# Altium schematic sheet Sheet1.SchDoc
size A3; SheetNumber: 1; SheetTotal: 1
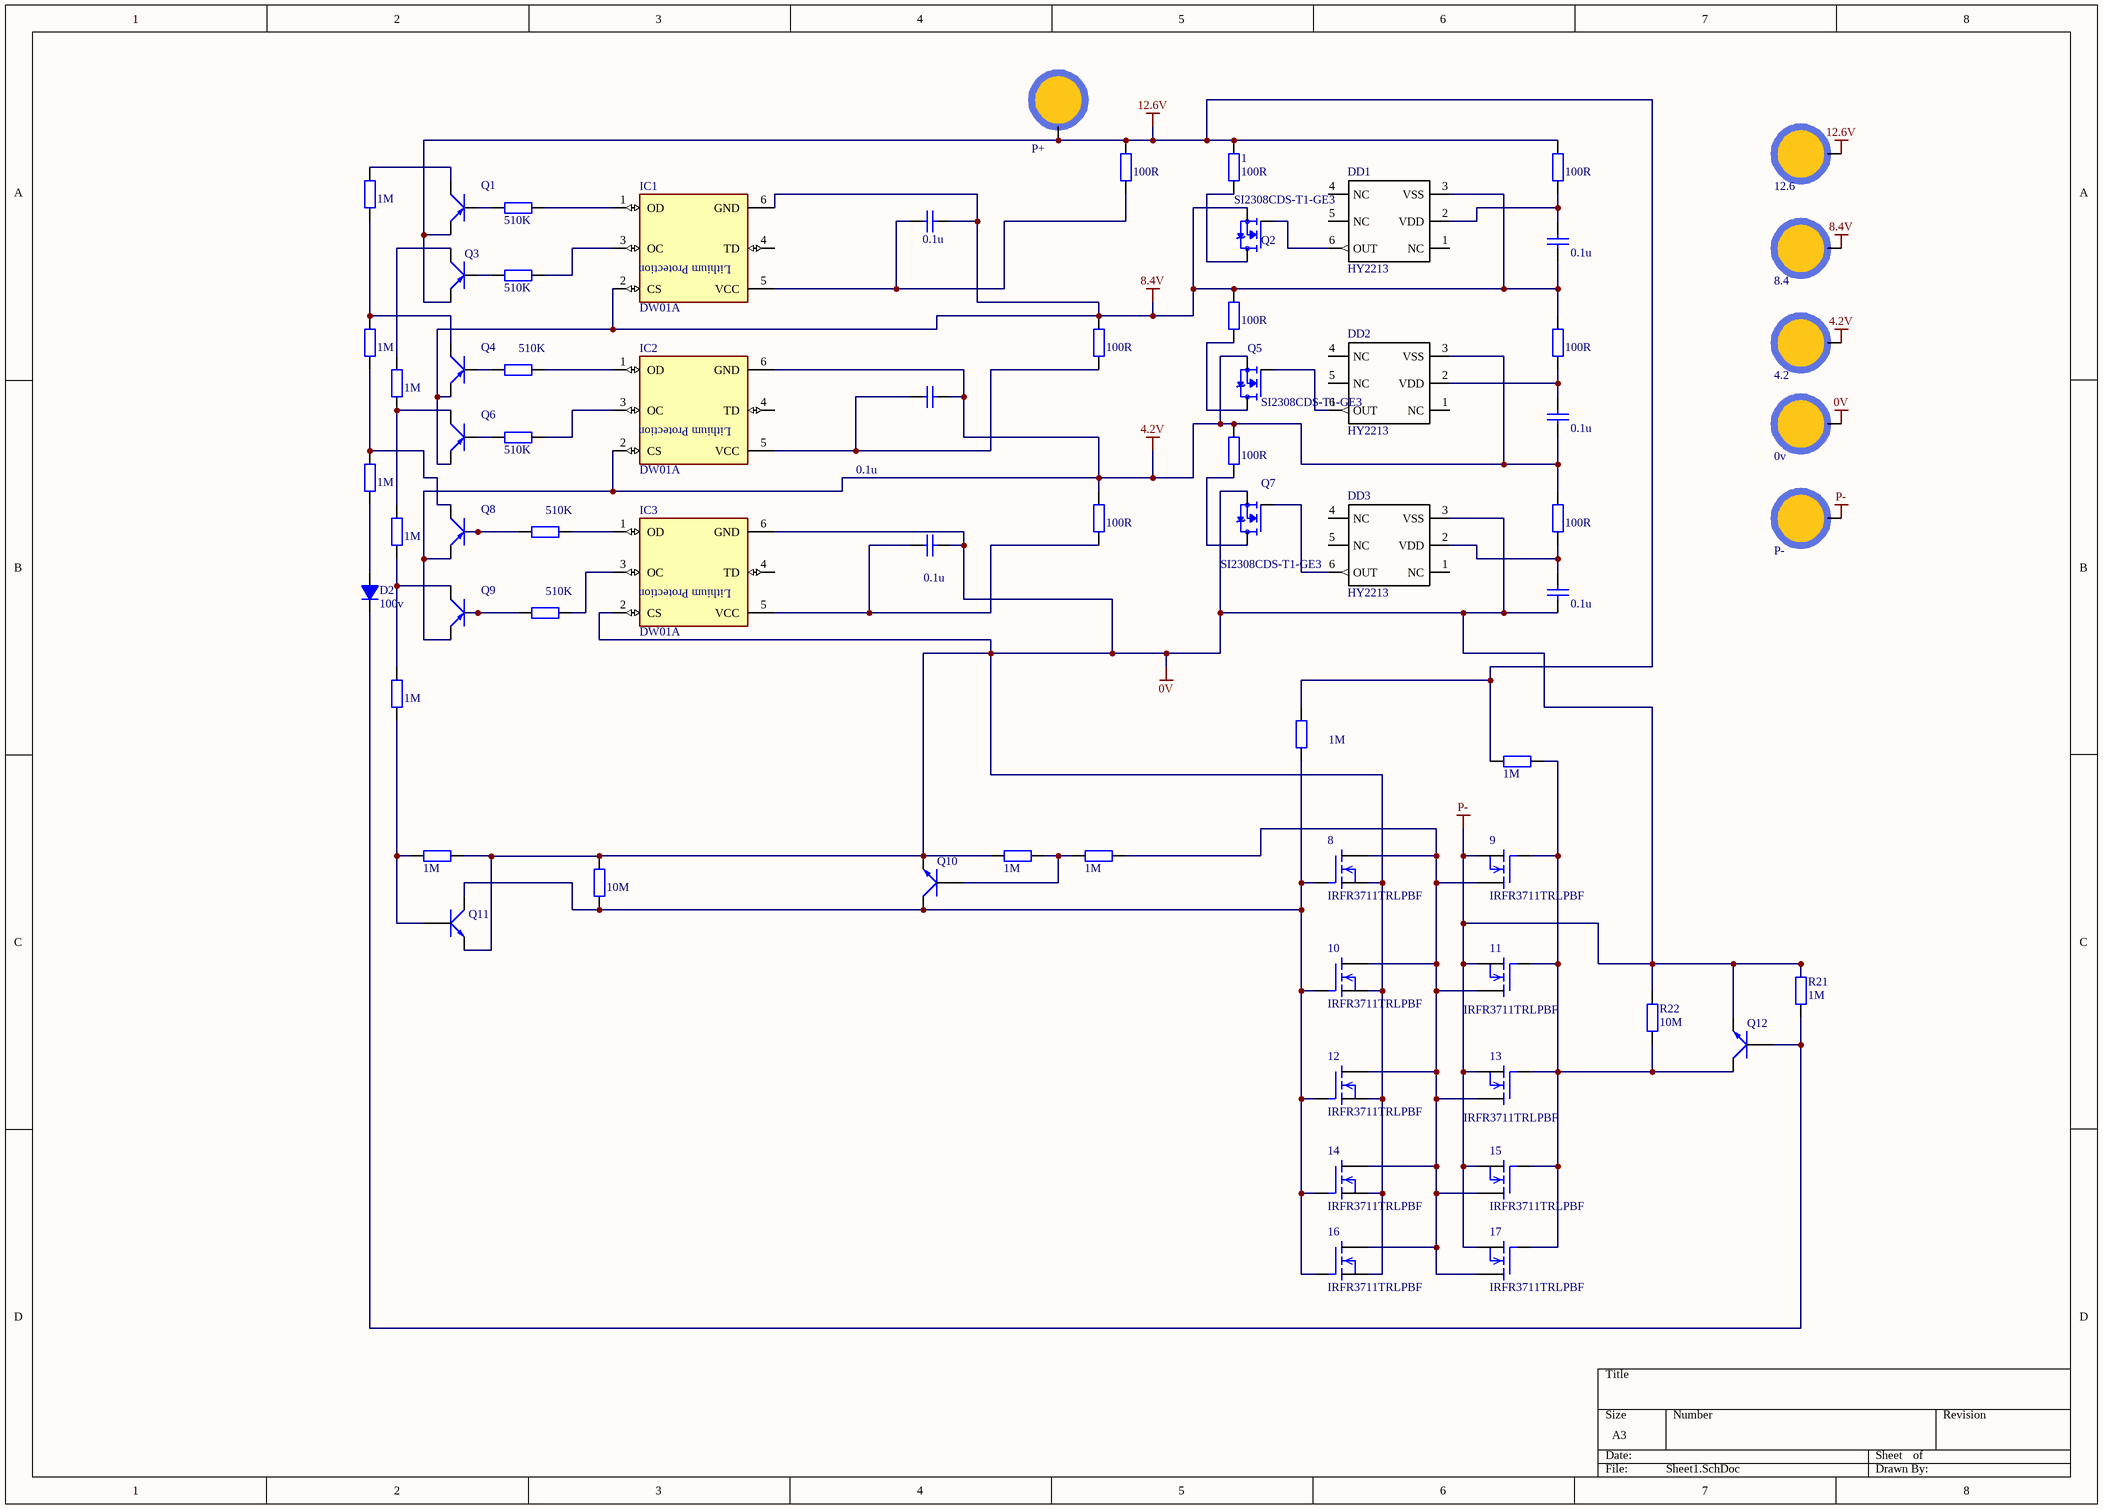
[diagram p0: Sheet1.SchDoc]

## Parts
0v  DNP/MH  [SOMH1]  (value not drawn)  (no BOM)
1  100R  [tro smd 2512]
2  1M  [tro smd 1206]
3  100R  [tro smd 2512]
4  1M  [tro smd 1206]
4.2  DNP/MH  [SOMH1]  (value not drawn)  (no BOM)
5  1M  [tro smd 1206]
6  100R  [tro smd 2512]
7  1M  [tro smd 1206]
8  IRFR3711TRLPBF  [TO252]
8.4  DNP/MH  [SOMH1]  (value not drawn)  (no BOM)
9  IRFR3711TRLPBF  [TO252]
10  IRFR3711TRLPBF  [TO252]
11  IRFR3711TRLPBF  [TO252]
12  IRFR3711TRLPBF  [TO252]
12.6  DNP/MH  [SOMH1]  (value not drawn)  (no BOM)
13  IRFR3711TRLPBF  [TO252]
14  IRFR3711TRLPBF  [TO252]
15  IRFR3711TRLPBF  [TO252]
16  IRFR3711TRLPBF  [TO252]
17  IRFR3711TRLPBF  [TO252]
C1  0.1u  [tu 1206]
C2  0.1u  [tu 1206]
C3  0.1u  [tu 1206]
C4  0.1u  [tu 1206]
C5  0.1u  [tu 1206]
C6  0.1u  [tu 1206]
D2  100v  [DIODE 0.5A]
DD1  HY2213  [SOT23-6]
DD2  HY2213  [SOT23-6]
DD3  HY2213  [SOT23-6]
IC1  DW01A  [SOT23-6]
IC2  DW01A  [SOT23-6]
IC3  DW01A  [SOT23-6]
P+  DNP/MH  [SOMH1]  (value not drawn)  (no BOM)
P-  DNP/MH  [SOMH1]  (value not drawn)  (no BOM)
Q1  BA  [SOT23]  (value not drawn)
Q2  SI2308CDS-T1-GE3  [SOT95P237X112-3N]
Q3  BA  [SOT23]  (value not drawn)
Q4  BA  [SOT23]  (value not drawn)
Q5  SI2308CDS-T1-GE3  [SOT95P237X112-3N]
Q6  BA  [SOT23]  (value not drawn)
Q7  SI2308CDS-T1-GE3  [SOT95P237X112-3N]
Q8  BA  [SOT23]  (value not drawn)
Q9  BA  [SOT23]  (value not drawn)
Q10  HF  [SOT23]  (value not drawn)
Q11  HF  [SOT23]  (value not drawn)
Q12  (no value)  [SOT23]
R1  100R  [tro smd 1206]
R2  100R  [tro smd 1206]
R3  510K  [tro smd 1206]
R4  510K  [tro smd 1206]
R5  510K  [tro smd 1206]
R6  100R  [tro smd 1206]
R7  100R  [tro smd 1206]
R8  510K  [tro smd 1206]
R9  510K  [tro smd 1206]
R10  100R  [tro smd 1206]
R11  100R  [tro smd 1206]
R12  1M  [tro smd 1206]
R13  510K  [tro smd 1206]
R14  1M  [tro smd 1206]
R15  1M  [tro smd 1206]
R16  1M  [tro smd 1206]
R17  1M  [tro smd 1206]
R18  1M  [tro smd 1206]
R19  1M  [tro smd 1206]
R20  10M  [tro smd 1206]
R21  1M  [tro smd 1206]
R22  10M  [tro smd 1206]

## Nets
0V: 0v.1 8.3(S) 9.3(S) 10.3(S) 11.3(S) 12.3(S) 13.3(S) 14.3(S) 15.3(S) 16.3(S) 17.3(S) C5.1 C6.2 DD3.3(VSS) IC3.2(CS) IC3.6(GND) P-.1 Q7.2(S) Q10.2(E) Q11.2(E) Q12.2(E) R17.1 R18.2 R20.1 R21.2 R22.1  [also labelled P-]
4.2V: 4.2.1 6.2 C3.1 C4.2 DD2.3(VSS) IC2.2(CS) IC2.6(GND) Q5.2(S) Q8.2(E) Q9.2(E) R10.2 R11.1
8.4V: 3.2 8.4.1 C1.1 C2.2 DD1.3(VSS) IC1.2(CS) IC1.6(GND) Q2.2(S) Q4.2(E) Q6.2(E) R6.1 R7.1
12.6V: 1.2 12.6.1 P+.1 Q1.2(E) Q3.2(E) R1.1 R2.1 R15.1 R16.1
Net1_1: 1.1 Q2.3(D)
Net2_1: 2.1 4.2 Q4.3(C)
Net2_2: 2.2 Q1.3(C)
Net3_1: 3.1 Q5.3(D)
Net4_1: 4.1 7.2 Q8.3(C)
Net5_1: 5.1 Q6.3(C) R12.2
Net5_2: 5.2 Q3.3(C)
Net6_1: 6.1 Q7.3(D)
Net7_1: 7.1 D2.1(A)
Net8_1: 8.1(G) 10.1(G) 12.1(G) 14.1(G) 16.1(G) Q10.3(C) Q11.3(C) R15.2 R20.2
Net8_2: 8.2(D) 9.2(D) 10.2(D) 11.2(D) 12.2(D) 13.2(D) 14.2(D) 15.2(D) 16.2(D) 17.2(D) R19.1
Net9_1: 9.1(G) 11.1(G) 13.1(G) 15.1(G) 17.1(G) Q12.3(C) R16.2 R22.2
NetC1_2: C1.2 IC1.5(VCC) R1.2
NetC2_1: C2.1 DD1.2(VDD) R2.2
NetC3_2: C3.2 IC2.5(VCC) R6.2
NetC4_1: C4.1 DD2.2(VDD) R7.2
NetC5_2: C5.2 IC3.5(VCC) R10.1
NetC6_1: C6.1 DD3.2(VDD) R11.2
NetD2_2: D2.2(K) Q12.1(B) R21.1
NetDD1_6: DD1.6(OUT) Q2.1(G)
NetDD2_6: DD2.6(OUT) Q5.1(G)
NetDD3_6: DD3.6(OUT) Q7.1(G)
NetIC1_1: IC1.1(OD) R3.2
NetIC1_3: IC1.3(OC) R4.2
NetIC2_1: IC2.1(OD) R5.1
NetIC2_3: IC2.3(OC) R8.1
NetIC3_1: IC3.1(OD) R9.1
NetIC3_3: IC3.3(OC) R13.1
NetQ1_1: Q1.1(B) R3.1
NetQ3_1: Q3.1(B) R4.1
NetQ4_1: Q4.1(B) R5.2
NetQ6_1: Q6.1(B) R8.2
NetQ8_1: Q8.1(B) R9.2
NetQ9_1: Q9.1(B) R13.2
NetQ9_3: Q9.3(C) R12.1 R14.2
NetQ10_1: Q10.1(B) R18.1 R19.2
NetQ11_1: Q11.1(B) R14.1 R17.2

Not connected (* = marked no-connect by the designer): DD1 1(NC) 4(NC) 5(NC); DD2 1(NC) 4(NC) 5(NC); DD3 1(NC) 4(NC) 5(NC); IC1 4(TD); IC2 4(TD); IC3 4(TD)

## Notes on the sheet
- (in symbol DW01A) Lithium Protection

## Library data of the parts
0v 4.2 8.4 12.6 P+ P- = SOMH1: Solder Mounting, Hole 1mm; ASSEMBLY: DNP; VALUE: DNP/MH
1 3 6 = Tro 2512 5% 100R: Dán; Don_Vi: Con; So_Chan: 2; Ten_Linh_Kien: Trở 2512 5% 101-100R; Ma_Hang: MH007974; Chung_Loai: Dán; Kieu_Chan: *
2 4 5 7 R1-R22 = Tro 1206 1% 0.68R: Dán; Don_Vi: Con; Ma_Hang: MH008104; Ten_linh_Kien: Trở 1206 1% 0.68R; So_Chan: 2; Chung_Loai: Dán; Kieu_Chan: *
8-17 = IRFR3711TRLPBF: N-Channel 20V 100A _Tc_ 2.5W _Ta_, 120W _Tc_ Surface Mount D-Pak; MF: Infineon; Package: TO-252 Infineon; Price: None; Value: *; MP: IRFR3711TRLPBF; Availability: Unavailable; SnapEDA_Link: https://www.snapeda.com/parts/IRFR3711TRLPBF/Infineon%20Technologies/view-part/757499/?ref=snap
C1-C6 = Tu 1206 4.7nF 50V: Dán; Don_Vi: Con; So_Chan: 2; Ten_Linh_Kien: Tụ 1206 4.7nF 50V NPO; Ma_Hang: MH007538; Chung_Loai: Dán; Kieu_Chan: *
D2 = Diode 1N4148: Cắm; Ten_Linh_Kien: Diode 1N4148 DO35 450mA 100V ( 1N4148 DIP); Don_Vi: Con; Ma_Hang: MH001065; Ghi Chu: *; Kieu_Chan: *; Chung_Loai: Cắm
DD1-DD3 = HY2213: 1 Cell Li-ion/Polymer Battery Charge Balance IC
IC1-IC3 = DW01A: One Cell Lithium-ion/Polymer Battery Protection IC; MF: Fortune Semiconductor; Value: *; Price: None; Availability: Not in stock; SnapEDA_Link: https://www.snapeda.com/parts/DW01A/Fortune+Semiconductor/view-part/?ref=snap; Check_prices: https://www.snapeda.com/parts/DW01A/Fortune+Semiconductor/view-part/?ref=eda; Package: SOT-23-6 Fortune Semiconductor; MP: DW01A
Q1 Q3 Q4 Q6 Q8 Q9 = A1015 BA SMD: PNP 600mW, ECB
Q2 Q5 Q7 = SI2308CDS-T1-GE3: N-Channel 60V 2.6A (Tc) 1.6W (Tc) Surface Mount SOT-23-3 (TO-236); MF: Vishay Siliconix; Package: SOT-23-3 Vishay Siliconix; MP: SI2308CDS-T1-GE3; Value: *; SnapEDA_Link: https://www.snapeda.com/parts/SI2308CDS-T1-GE3/Vishay%20Siliconix/view-part/2523766/?ref=snap; Availability: Unavailable; Price: None
Q10-Q12 = C1815 HF SMD: NPN transistor; Value: C9014